# Altium schematic sheet Main.SchDoc: Main
size A4; SheetNumber: 1; SheetTotal: 3
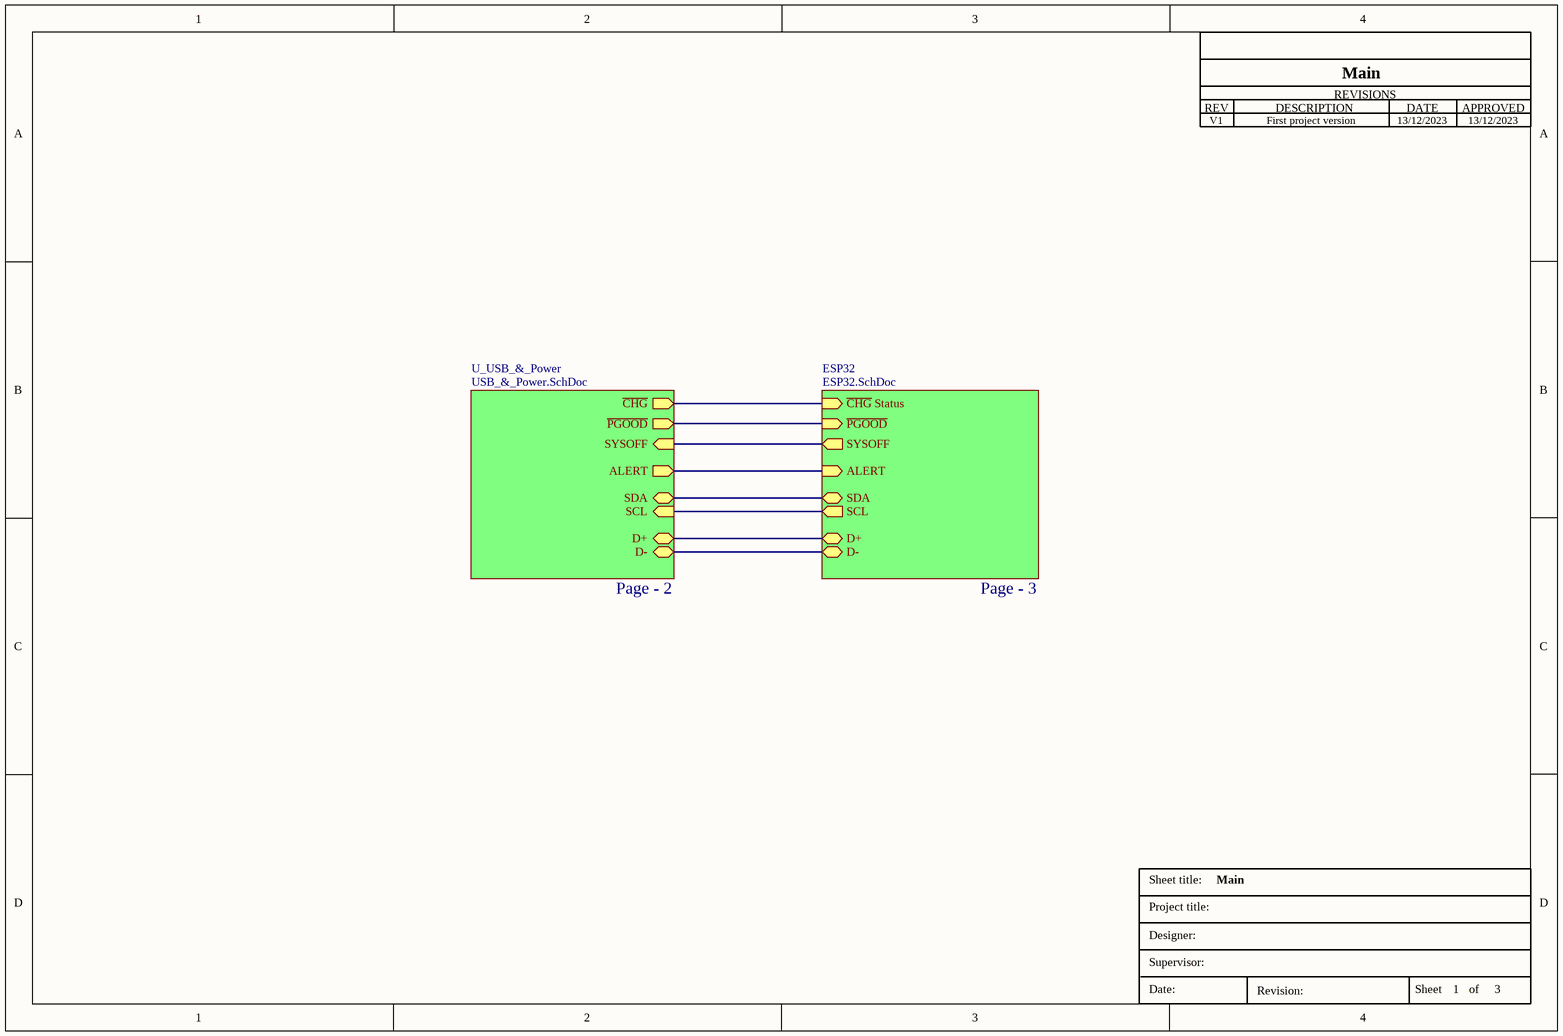
[diagram p0: Main.SchDoc]

## Sub-sheets
ESP32 = ESP32.SchDoc: ~{CHG} Status (in), ~{PGOOD} (in), D- (bidir), D+ (bidir), ALERT (in), SDA (bidir), SCL (out), SYSOFF (out)
U_USB_&_Power = USB_&_Power.SchDoc: ~{CHG} (out), ~{PGOOD} (out), D- (bidir), D+ (bidir), ALERT (out), SDA (bidir), SCL (in), SYSOFF (in)

## Nets
(unnamed): sheet U_USB_&_Power/~{CHG}, sheet ESP32/~{CHG} Status
(unnamed): sheet U_USB_&_Power/~{PGOOD}, sheet ESP32/~{PGOOD}
(unnamed): sheet U_USB_&_Power/D-, sheet ESP32/D-
(unnamed): sheet U_USB_&_Power/D+, sheet ESP32/D+
(unnamed): sheet U_USB_&_Power/ALERT, sheet ESP32/ALERT
(unnamed): sheet U_USB_&_Power/SDA, sheet ESP32/SDA
(unnamed): sheet U_USB_&_Power/SCL, sheet ESP32/SCL
(unnamed): sheet U_USB_&_Power/SYSOFF, sheet ESP32/SYSOFF

## Notes on the sheet
- REV
- REVISIONS
- DESCRIPTION
- DATE
- APPROVED
- Workaround for Arduino IDE:
  Edit BleKeyboard.h and put #define USE_NIMBLE before the first line
  Edit BleKeyboard.cpp and move line 17 before the first line
  Edit pins number in Config_Definitions.h
  Edit SparkButtonHandler.cpp BfButton false, HIGH to ture, LOW and line 51,53 HIGH to LOW
- V1
- First project version
- 13/12/2023
- Page - 2
- Page - 3
- Sheet title:
- Project title:
- Designer:
- Supervisor:
- Date:
- Revision:
- Sheet
- of